# Altium project IEA_uRobots_v2.PrjPcb (part 2 of 2)
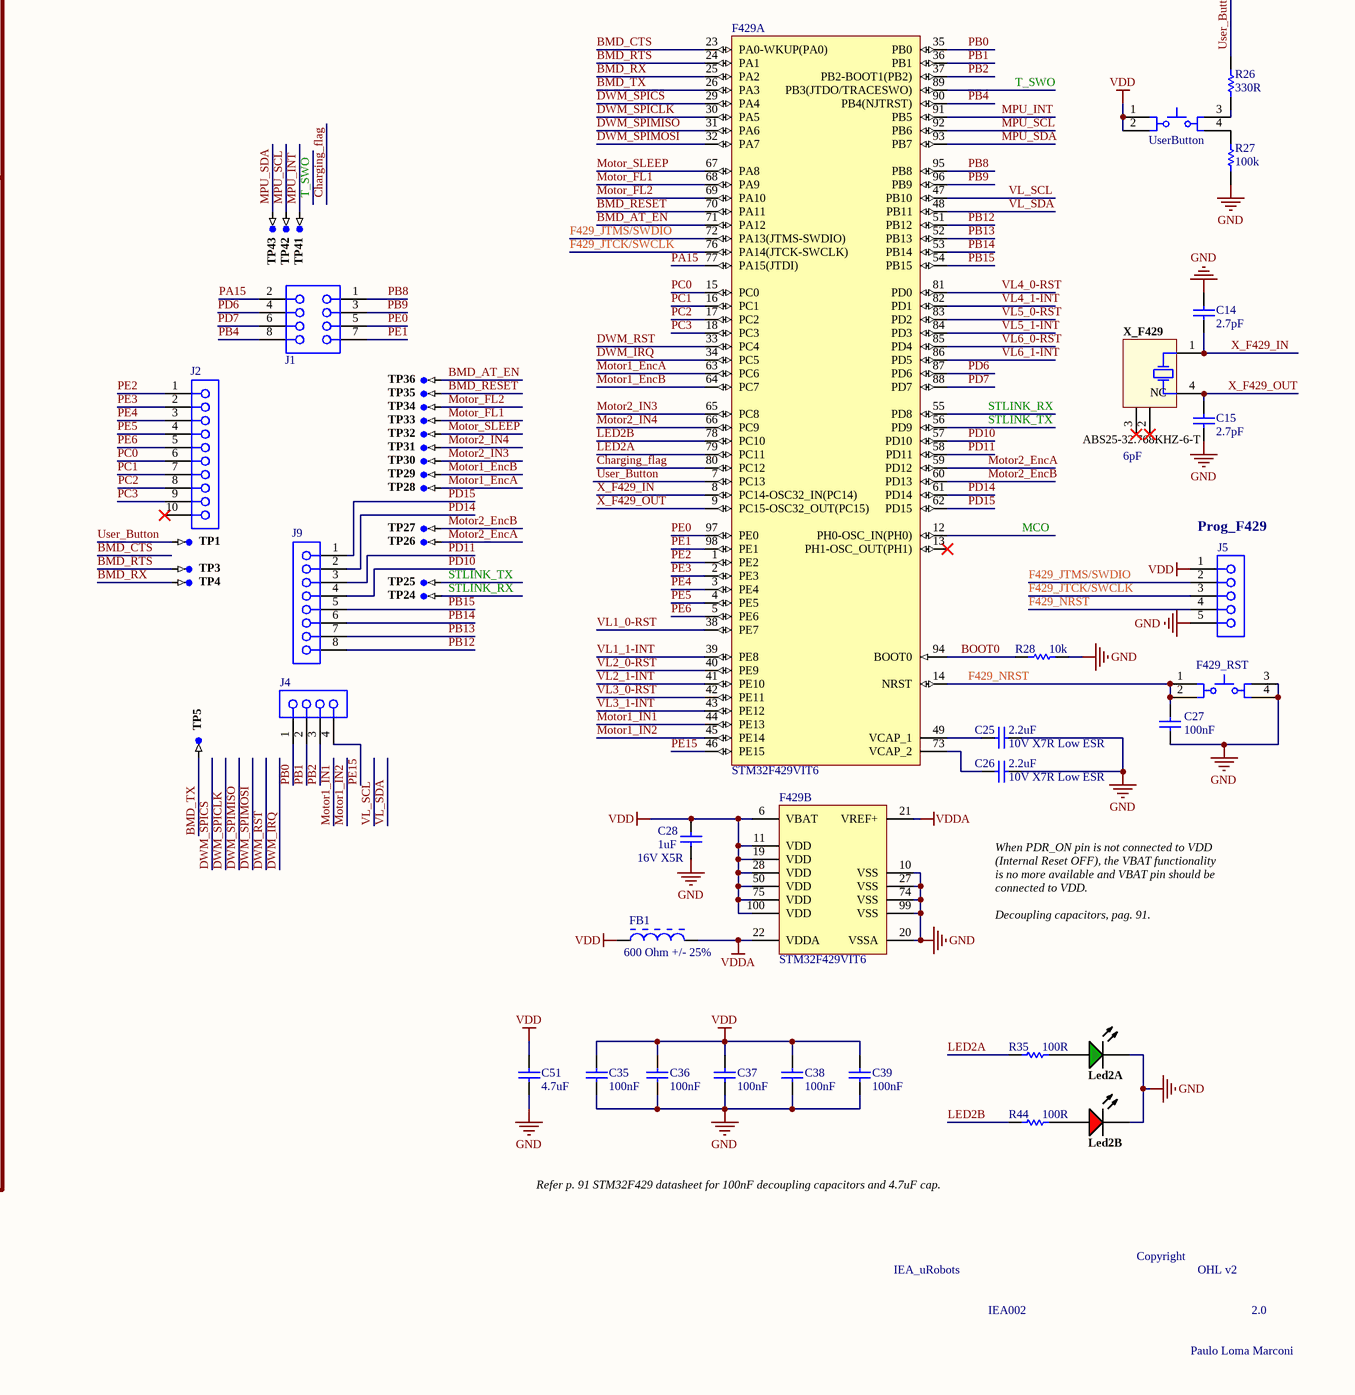
[diagram p4: IEA_uRobots_v2.SchDoc, bottom right]

## Sheet IEA_uRobots_v2.SchDoc: IEA_uRobot v2 (continued)

### Library data of the parts
3V3toVDD = CMP-1712-00002-3: Male Header, Pitch 2.54 mm, 1 x 2 Position, Height 8.54 mm, Tail Length 3 mm, -40 to 105 degC, RoHS, Bulk; PartNumber: 613 002 111 21; Mounting Technology: Through Hole; Packaging: Bulk; Pins: 2; REACH SVHC: No SVHC; PackageDescription: Male Header, Pitch 2.54 mm, 1 x 2 Position, Height 8.54 mm, Tail Length 3 mm; ComponentLink1Description: Manufacturer URL; Max Operating Temperature: 125 degC; ComponentLink1URL: https://www.we-online.com/; ComponentLink2Description: Datasheet; Mount: Through Hole; DatasheetVersion: Rev. J; Min Operating Temperature: -40 degC; ComponentLink2URL: http://katalog.we-online.de/em/datasheet/6130xx11121.pdf; RoHSCompliant: True
BAT VIN = CMP-2000-05417-1: Male Header, Pitch 2.54 mm, 1 x 2 Position, Height 10.49 mm, Tail Length 3.556 mm, -55 to 105 degC, RoHS, Bulk; Manufacturer: TE Connectivity; Standards: RoHSCompliant,ELVCompliant,UL94V-0; Material, Housing: Polyester; Agency Approvals: CSA,UL; Brand/Series: MTA-100Series; Contact Centerline Spacing: 0.100 / in.; Material, Contact: CopperAlloy; Current, Rating: 5 / A; Color, Housing: White; Contact Termination Area Plating: Tin; Special Features: Pinstrip; Number of Positions: 2; Temperature, Operating: -55to+105 / degC; Angle: Straight; Mount Angle: Vertical; Connector Type: MTA-100; Primary Type: InterconnectSystem; Voltage, Rating: 250 / V; Number of Rows: 1; Termination: Solder; Length, Terminal Post: 0.14 / in.; Manufacturer URL: http://www.te.com/; Color: White; Size, Post: 0.025 / in.; Contact Shape: Square; Mounting Type: PCMount; Datasheet URL: https://datasheet.ciiva.com/11746/0900766b80eb7fdd-11746365.pdf; Type: PCBPlug; Datasheet Version: Rev. W, 06/2004; Number of Contacts: 2; Flammability Rating: UL94V-0; Contact Plating: Tin; Contact Mating Area Plating: Tin
BMD = BMD-300-A: Bluetooth 4.2 LE Module, nRF52832, 512kB Flash, 64kB RAM; Manufacturer: Rigado; Internal Antenna: Yes; Protocol: BLE 4.2; RF Freq: 2.4GHz; Added By: Cam N; Part Number: BMD-300-A; Size: 14mm x 9.8mm; Height: 1.9mm; Added Date: 10/14/2015
BMD_AT_EN BMD_RST UserButton = CMP-2000-07594-1: Tact Switch, SPST-NO, 50 mA, -20 to 60 degC, 4-Pin SMD, RoHS, Tape and Reel; Manufacturer: C&K Components; Actuator Length: 0.85mm; Voltage Rating (DC): 12V; Mechanical Life: 100000Cycles; Illumination Type: Illuminated; Throw Configuration: SPST; Switch Function: Off-Mom; Actuator Material: Polyamide; Contact Resistance: 100mOhm; Max Current Rating: 50mA; Operating Force: 160gf; Case\/Package: SMD/SMT; Orientation: Straight; RoHSCompliant: True; Manufacturer URL: http://www.ckswitches.com/; Package Quantity: 1000; Datasheet URL: http://www.ckswitches.com/media/1471/pts645.pdf; Colour: Black; Min Operating Temperature: -20degC; Length: 6mm; Mount: SurfaceMount; Depth: 9mm; Max Voltage Rating (DC): 12V; Package Reference: PTS645S; REACH SVHC: NoSVHC; Contact Material: Silver; Packaging: TapeandReel; Package Description: 4-Pin Surface Mount Device, Body 6 x 6 mm, Pitch 4.5 mm; Max Operating Temperature: 60degC; Lead Free: LeadFree; Termination: GullWing; Current Rating: 50mA; Datasheet Version: 04/2016; Mounting Technology: SurfaceMount; Contact Plating: Silver
C1 C2 C14 C15 = CMP-1034-00206-1: CAP 2.7pF 16V ±0.25pF 0402 (1005 Metric) Thickness 0.6mm SMD; Case-Metric: 1005; Case-EIA: 0402; Tolerance: Â±0.25pF; Technology: SMT; Max Thickness: 0.6 mm; Rated Voltage: 16 V
C3 C8 = CMP-1036-00837-1: CAP 10pF 16V ±10% 0805 (2012 Metric) Thickness 1mm SMD; Tolerance: Â±10%; Case-EIA: 0805; Case-Metric: 2012; Rated Voltage: 16 V; Max Thickness: 1 mm; Technology: SMT
C4 C16 C17 C19 C21 C24 C27 C30 C32 C35-C40 C43 C52-C59 = CMP-1036-04420-1: CAP 100nF 50V ±10% 0805 (2012 Metric) Thickness 1mm SMD; Case-EIA: 0805; Tolerance: Â±10%; Case-Metric: 2012; Rated Voltage: 50 V; Max Thickness: 1 mm; Technology: SMT
C5 C51 = CMP-2007-03546-1: Manufacturer: Murata; Part Number: GRM21BR61E475MA12L
C6 C7 = CMP-1036-02452-1: CAP 300pF 50V ±1% 0805 (2012 Metric) Thickness 1mm SMD; Case-Metric: 2012; Case-EIA: 0805; Tolerance: Â±1%; Rated Voltage: 50 V; Max Thickness: 1 mm; Technology: SMT
C9 C11 = CMP-1033-00657-1: CAP 100nF 4V ±10% 0201 (0603 Metric) Thickness 0.33mm SMD; Case-EIA: 0201; Tolerance: Â±10%; Case-Metric: 0603; Technology: SMT; Max Thickness: 0.33 mm; Rated Voltage: 4 V
C10 C23 = CMP-1033-00635-1: CAP 10nF 6.3V ±10% 0201 (0603 Metric) Thickness 0.33mm SMD; Case-Metric: 0603; Tolerance: Â±10%; Case-EIA: 0201; Rated Voltage: 6.3 V; Max Thickness: 0.33 mm; Technology: SMT
C12 C13 = CMP-2000-06039-1: Chip Capacitor, 4.7 uF, +/- 10%, 25 V, -55 to 125 degC, 0805 (2012 Metric), RoHS, Tape and Reel; Manufacturer: TDK; PCN Part Number: MLCCPartNumberChange30/Nov/2012; Other Names: 445-5972-2C2012X7R1E475KC2012X7R1E475KT000N; Temperature Coefficient: X7R; Voltage - Rated: 25V; Product Training Modules: CSeriesGeneralApplicationsSEAT,CCV,andTVCLDesignToolsGuidetoReplacinganElectrolyticCapacitorwithanMLCC; Catalog Drawings: CSERIES_2012-0805_1.45; Online Catalog: CSeries,GeneralPurpose; Package Description: 2-Pin Surface Mount Device, Body 2 x 1.25 mm; Manufacturer URL: http://www.tdk.com/; Features: -; Family: CeramicCapacitors; Applications: GeneralPurpose; Standard Package: 2,000; RoHS Information: RoHSCertificate-MLCC; Operating Temperature: -55°C~125°C; Lead Spacing: -; Lead Style: -; Datasheet Version: 01/2016; Datasheet URL: https://product.tdk.com/info/en/documents/chara_sheet/C2012X7R1E475K125AB.pdf; Series: C; Package Reference: 0805; Category: Capacitors; Ratings: -; Packaging: Tape&Reel(TR); Tolerance: ±10%; Height - Seated (Max): -; Package / Case: 0805(2012Metric); Mounting Technology: SurfaceMount; Mounting Type: SurfaceMount,MLCC
C18 = CMP-2000-07390-1: Chip Capacitor, 10 uF, +/- 10%, 10 V, -55 to 85 degC, 0805 (2012 Metric), RoHS, Tape and Reel; Manufacturer: Vishay; Unit Weight: 0.000194oz; Voltage Rating DC: 10VDC; Brand: Vishay/Vitramon; Dielectric: X5R; Series: VJW1BC; Mounting Technology: SurfaceMount; Case Code - in: 0805; Package Description: 2-Pin Surface Mount Device, Body 2.00 x 1.25 mm; Case Code - mm: 2012; Length: 2mm; Datasheet Version: 07/2016; Manufacturer URL: http://www.vishay.com/; Product Category: MultilayerCeramicCapacitorsMLCC-SMD/SMT; Maximum Operating Temperature: +85C; Datasheet URL: http://www.vishay.com/docs/28548/vjw1bcbascomseries.pdf; Factory Pack Quantity: 3000; Termination Style: SMD/SMT; Package / Case: 0805(2012metric); Minimum Operating Temperature: -55C; Package Reference: 0805; RoHS: True; Width: 1.25mm; Height: 1.25mm; Tolerance: 10%; Packaging: Reel
C20 C22 C28 C29 C31 C41 C42 = CMP-1036-04747-1: CAP 1uF 16V ±10% 0805 (2012 Metric) Thickness 1mm SMD; Tolerance: Â±10%; Case-Metric: 2012; Case-EIA: 0805; Technology: SMT; Rated Voltage: 16 V; Max Thickness: 1 mm
C25 C26 = CMP-1036-04824-1: CAP 2.2uF 10V ±10% 0805 (2012 Metric) Thickness 1.45mm SMD; Case-Metric: 2012; Tolerance: Â±10%; Case-EIA: 0805; Max Thickness: 1.45 mm; Technology: SMT; Rated Voltage: 10 V
C33 C34 = CMP-2000-07390-1: Chip Capacitor, 10 uF, +/- 10%, 10 V, -55 to 85 degC, 0805 (2012 Metric), RoHS, Tape and Reel; Manufacturer: Vishay; Unit Weight: 0.000194oz; Voltage Rating DC: 10VDC; Brand: Vishay/Vitramon; Series: VJW1BC; Mounting Technology: SurfaceMount; Case Code - in: 0805; Capacitance: 10uF; Package Description: 2-Pin Surface Mount Device, Body 2.00 x 1.25 mm; Case Code - mm: 2012; Length: 2mm; Datasheet Version: 07/2016; Manufacturer URL: http://www.vishay.com/; Product Category: MultilayerCeramicCapacitorsMLCC-SMD/SMT; Maximum Operating Temperature: +85C; Datasheet URL: http://www.vishay.com/docs/28548/vjw1bcbascomseries.pdf; Factory Pack Quantity: 3000; Dielectric: X5R; Termination Style: SMD/SMT; Package / Case: 0805(2012metric); Minimum Operating Temperature: -55C; Package Reference: 0805; RoHS: True; Width: 1.25mm; Height: 1.25mm; Tolerance: 10%; Packaging: Reel
CN1 CN3 CN4 = CMP-1024-00081-1: PartNumber: MTLW-106-05-F-S-210; Manufacturer: Samtec; Pitch: 2.54 mm; Orientation: Vertical; ComponentLink1URL: http://www.samtec.com; ComponentLink3URL: http://www.samtec.com/documents/webfiles/cpdf/MTLW-1XX-XX-XX-X-XXX-XX-XX-MKT1.pdf; PackageReference: MTLW-106-05-X-S-210; DatasheetVersion: F-214; ComponentLink2URL: http://www.samtec.com/documents/webfiles/pdf/MTLW_TH.PDF; PackageVersion: T, 6/1991; RoHS: True; ComponentLink1Description: Manufacturer URL; ComponentLink3Description: Package Specification; ComponentLink2Description: Datasheet; PackageDescription: Low Profile Terminal Assembly; Temperature Range: -55 to 125 degC; Mounting Technology: Through-hole
CN2 = CMP-1024-00379-1: Manufacturer: Samtec; PartNumber: TSW-106-07-G-D; Pitch: 2.54 mm; ComponentLink1URL: http://www.samtec.com; DatasheetVersion: F-214; ComponentLink3URL: http://www.samtec.com/documents/webfiles/cpdf/TSW-XXX-XX-XXX-X-XX-XXX-MKT.pdf; PackageVersion: DM, 8/1988; Mounting Technology: Through-hole; ComponentLink1Description: Manufacturer URL; Orientation: Vertical; PackageDescription: .025[0.64] SQ. Post Terminal Strip Assembly; ComponentLink2URL: http://www.samtec.com/documents/webfiles/pdf/TSW_TH.PDF; RoHS: True; ComponentLink3Description: Package Specification; ComponentLink2Description: Datasheet; PackageReference: TSW-106-07-X-D; Temperature Range: -55 to 125 degC
D2-D4 = CMP-2000-05927-1: Small Signal Schottky Diode, 40 V, 300 mA, -40 to 150 degC, 2-Pin SOD-323, RoHS, Tape and Reel; Manufacturer: STMicroelectronics; Current - Reverse Leakage @ Vr: 1µA@30V; Capacitance @ Vr, F: 10pF@1V,1MHz; Other Related Documents: BAT54ViewAllSpecifications; Voltage - DC Reverse (Vr) (Max): 40V; Voltage - Forward (Vf) (Max) @ If: 900mV@100mA; Other Names: 497-7163-6; Reverse Recovery Time (trr): 5ns; Speed: FastRecovery=200mA(Io); Current - Average Rectified (Io): 300mA(DC); Standard Package: 1; Datasheet Version: Rev. 10, 10/2009; Package / Case: SC-76,SOD-323; Diode Type: Schottky; Package Description: 2-Pin Surface Mount Device, Body 1.66 x 1.28 mm, Height 1.17 mm; Operating Temperature - Junction: -40°C~150°C; Package Reference: SOD-323-2; Family: Diodes,Rectifiers-Single; Packaging: Digi-Reel®; Datasheet URL: http://www.stm32circle.com/resources/Datasheets/BAT60J.pdf; Supplier Device Package: SOD-323; Online Catalog: SchottkyDiode; Category: DiscreteSemiconductorProducts; Series: -; Manufacturer URL: http://www.st.com/; Mounting Technology: SurfaceMount; Mounting Type: SurfaceMount
DWM = CMP-2000-05094-1: DW M1000 IEEE 802.15.4 -2011 UWB Transceiver Module; Manufacturer: Decawave; Voltage - Supply: 2.8V~3.6V; Protocol: IR-UWB; Featured Product: ScenSorDWM1000Module; Design Resources: DevelopmentToolSelector; Frequency: 3.5GHz~6.5GHz; Antenna Type: Integrated,Chip; Other Names: 1479-1002-2RUPF-G001A; Current - Receiving: 64mA; Data Rate: 6.8Mbps; Serial Interfaces: SPI; Current - Transmitting: 31mA; Modulation: BPM,BPSK; Standard Package: 500; Series: -; RF Family/Standard: 802.15.4; Operating Temperature: -40degC~85degC; Sensitivity: -; Packaging: Tape&Reel(TR); Datasheet Version: Rev. V1.0, 12/2015; Power - Output: -; Family: RFTransceiverModules; Memory Size: -; Package / Case: Module; Mounting Type: SurfaceMount; Datasheet URL: http://www.decawave.com/sites/default/files/resources/dwm1000-datasheet-v1.3.pdf; Online Catalog: ScenSorDWM1000Module; Category: RF/IFandRFID; Manufacturer URL: http://www.decawave.com/; Supplier 1: Digi-Key; Supplier Part Number 1: 1479-1002-1-ND
ESD = CMP-2000-05378-1: Very low capacitance ESD protection, 3.5 pF, -40 to 125 degC, 6-Pin SOT23, RoHS, Tape and Reel; Manufacturer: STMicroelectronics; Polarity: Uni-Directional; Clamping Voltage: 17V; Rad Hardened: No; Product Height (mm): 1.3mm; Leakage Current (Max): 0.15uA; Product Length (mm): 3.05mm; Number of Elements: 1; Peak Pulse Current: 5A; Configuration: Dual; Reverse Breakdown Voltage: 6V; Working Voltage (Max): 5V; Capacitance Value: 3.5pF; Suppressor Type: DiodeArrays; Product Depth (mm): 1.75mm; Test Current (It): 1mA; Package / Case: SOT-23; Operating Temperature Max Deg. C: 125C; Package Description: 6-Pin Small Outline Transistor, Body 2.925 x 1.625 mm, Pitch 0.95 mm; Package Reference: SOT23-6L; Datasheet Version: Rev. 5, 10/2011; Operating Temperature Min Deg. C: -40C; Mounting Style: SurfaceMount; Direction Type: Uni-Directional; Mounting: SurfaceMount; Pin Count: 6; Leakage Current: 0.15uA; Packaging: TapeandReel; Operating Temperature Classification: Automotive; Clamping Voltage (Max): 17V; Manufacturer URL: http://www.st.com/; Reverse Stand-off Voltage: 5V; Datasheet URL: http://www.st.com/st-web-ui/static/active/en/resource/technical/document/datasheet/CD00050750.pdf; Working Voltage: 5V; Operating Temp Range: -40Cto125C; Supplier 1: Digi-Key; Supplier Part Number 1: 497-5235-1-ND
F103 = CMP-0237-00215-3: ARM Cortex-M3 32-bit MCU, 64 KB Flash, 20 KB Internal RAM, 37 I/Os, 48-pin LQFP, -40 to 85 degC, Tray; Supply Voltage(Vcc) min (V): 2; Internal RAM Size (kB): 20; FLASH Size (Prog) (kB): 64; A/D Converter: 2x12-bit (10 Channel); I/Os (High Current): 37; Operating Frequency(F) (Processor speed) (MHz): 72; Core: ARM Cortex-M3; ComponentLink3Description: Package Specification; Mounting Technology: Surface Mount; PartNumber: STM32F103C8T6; PackageReference: LQFP48; Packing: Tray; ComponentLink3URL: http://www.st.com/st-web-ui/static/active/en/resource/technical/document/datasheet/DM00058181.pdf; DatasheetVersion: Rev. 16; ComponentLink1URL: http://www.st.com/web/en/home.html; PackageVersion: Rev. 6, 06/2013; ComponentLink2URL: http://www.st.com/st-web-ui/static/active/en/resource/technical/document/datasheet/CD00161566.pdf; ComponentLink1Description: Manufacturer URL; ComponentLink2Description: Datasheet; PackageDescription: 48-Pin Low Profile Quad Flat Package, 7 x 7 mm Body, 0.5 mm Pitch; PartId: 1
F429 = CMP-0243-00030-2: ARM Cortex-M4 32-bit MCU+FPU, 225 DMIPS, 2048 kB Flash, 256 kB Internal RAM, 82 I/Os, 100-pin LQFP, -40 to 85 degC, Tray; Manufacturer: STMicroelectronics; FLASH Size (Prog) (kB): 2048; Supply Voltage(Vcc) min (V): 1.8; Operating Frequency(F) (Processor speed) (MHz): 180; Supply Voltage(Vcc) max (V): 3.6; D/A Converter: 2x12-bit; Internal RAM Size (kB): 256; I/Os (High Current): 82; Mounting Technology: Surface Mount; ComponentLink3URL: http://www.st.com/st-web-ui/static/active/en/resource/technical/document/data_brief/DM00071938.pdf; ComponentLink2URL: http://www.st.com/st-web-ui/static/active/en/resource/technical/document/data_brief/DM00053488.pdf; ComponentLink3Description: Package Specification; Packing: Tray; PackageDescription: 100-Pin Low Profile Quad Flat Package, 14 x 14 mm Body, 0.5 mm Pitch; PartNumber: STM32F429VIT6; ComponentLink2Description: Datasheet; ComponentLink1Description: Manufacturer URL; ComponentLink1URL: http://www.st.com/web/en/home.html; DatasheetVersion: Rev. 2; Core: ARM Cortex-M4; PackageReference: LQFP100; PackageVersion: Rev. 1, 06/2013; PartId: 1
F429_RST = CMP-2000-07594-1: Tact Switch, SPST-NO, 50 mA, -20 to 60 degC, 4-Pin SMD, RoHS, Tape and Reel; Manufacturer: C&K Components; Actuator Length: 0.85mm; Voltage Rating (DC): 12V; Mechanical Life: 100000Cycles; Illumination Type: Illuminated; Colour: Black; Throw Configuration: SPST; Switch Function: Off-Mom; Actuator Material: Polyamide; Contact Resistance: 100mOhm; Max Current Rating: 50mA; Operating Force: 160gf; Case\/Package: SMD/SMT; Orientation: Straight; RoHSCompliant: True; Manufacturer URL: http://www.ckswitches.com/; Package Quantity: 1000; Datasheet URL: http://www.ckswitches.com/media/1471/pts645.pdf; Min Operating Temperature: -20degC; Length: 6mm; Mount: SurfaceMount; Depth: 9mm; Max Voltage Rating (DC): 12V; Package Reference: PTS645S; REACH SVHC: NoSVHC; Contact Material: Silver; Packaging: TapeandReel; Package Description: 4-Pin Surface Mount Device, Body 6 x 6 mm, Pitch 4.5 mm; Max Operating Temperature: 60degC; Lead Free: LeadFree; Termination: GullWing; Current Rating: 50mA; Datasheet Version: 04/2016; Mounting Technology: SurfaceMount; Contact Plating: Silver
FB1 = CMP-0686-00639-2: Chip Ferrite Bead for General Signal lines, 600 Ohm, 600 mA, -55 to 125 degC, 2 x 1.25 x 1.05 mm SMD, Tape and Reel; Manufacturer: Murata; Rated Current: 600 mA; DC Resistance: 0.21 Ohm Max.; PackageReference: BLM21_H1050-2; ComponentLink2Description: Datasheet; PartNumber: BLM21AG601SN1D; PackageDescription: 2-Pin Chip, Body 2 x 1.25 mm; ComponentLink3Description: Package Specification; ComponentLink2URL: http://www.murata.com/products/catalog/pdf/c31e.pdf; ComponentLink3URL: http://www.murata.com/products/catalog/pdf/c31e.pdf; ComponentLink1Description: Manufacturer URL; Mounting Technology: Surface Mount; Packing: Tape and Reel; Operating Temperature Range: -55 to 125 degC; ComponentLink1URL: http://www.murata.com/; DatasheetVersion: 08/2013
IMU#1 IMU#2 = CMP-2100-03657-1: 9-axis MotionTracking device, 2.4 to 3,6 V, -40 to 85 degC, 24-Pin QFN, RoHS, Tape and Reel; Manufacturer: InvenSense; Max Supply Voltage: 3.6V; Min Supply Voltage: 2.4V; Package Reference: QFN-24; Package Quantity: 1; Datasheet Version: Rev. 1.0, 01/2014; Case/Package: QFN; Package Description: 24-Pin Quad Flat No-lead Package, Body 3 x 3 mm, Pitch 0.4 mm; RoHSCompliant: true; Max Operating Temperature: 85degC; Height: 1mm; Mount: SurfaceMount; Manufacturer URL: http://www.invensense.com/; Width: 3.1mm; Min Operating Temperature: -40degC; Length: 3.1mm; PartId: 1
  IMU#1: Datasheet URL: https://www.invensense.com/wp-content/uploads/2015/02/PS-MPU-9250A-01-v1.1.pdf
  IMU#2: Datasheet URL: http://datasheet.octopart.com/MPU-9250-InvenSense-datasheet-21859386.pdf
J1 = CMP-1023-00342-1: SQ Post Socket, Through-hole, Vertical, -55 to 105 degC, 2.54mm Pitch, 8-Pin, Female, RoHS; Manufacturer: Samtec; Mounting Technology: Through-hole; ComponentLink3Description: Package Specification; ComponentLink3URL: http://www.samtec.com/documents/webfiles/cpdf/SSW-1XX-XX-XXX-X-XX-XXX-XX-MKT.pdf; Temperature Range: -55 to 105 degC; DatasheetVersion: F-214; PackageVersion: CA, 6/1987; ComponentLink1URL: http://www.samtec.com; RoHS: True; Pitch: 2.54 mm; ComponentLink2Description: Datasheet; ComponentLink2URL: http://www.samtec.com/documents/webfiles/pdf/SSW_TH.PDF; PackageDescription: Assembly, Socket Strip .016 X .031 Tail; PackageReference: SSW-104-02-X-D; ComponentLink1Description: Manufacturer URL; PartNumber: SSW-104-02-T-D; Orientation: Vertical
J2 = CMP-1272-00002-1: SOCKET, Through-hole, Vertical, -55 to 125 degC, 2.54 mm Pitch, 10-Pin Female, RoHS; Manufacturer: Samtec; Packing: Bulk; Number of Positions: 10; Pitch: 2.54 mm; PackageVersion: Rev. A; ComponentLink1Description: Manufacturer URL; Contact Type: Female Socket; ComponentLink2URL: http://www.samtec.com/documents/webfiles/cpdf/SSW-1XX-XX-XXX-X-XX-XXX-XX-MKT.pdf; DatasheetVersion: Rev. CA; ComponentLink1URL: http://www.samtec.com/; Orientation: Vertical; PackageDescription: 1x10 Pins SQ Post Socket, Vertical, Body 25.5 x 2.41 mm, Pitch 2.54 mm, Female; Operating Temperature Range: -55 to 125 degC; PartNumber: SSW-110-01-G-S; ComponentLink3URL: http://www.samtec.com/documents/webfiles/cpdf/SSW-S.PDF; Contact Finish: Gold; Mounting Technology: Through Hole; ComponentLink3Description: Package Specification; Number of Rows: 1; RoHS: TRUE; Termination: Through-hole; ComponentLink2Description: Datasheet
J3 J4 = CMP-1023-00130-1: Low Profile Socket Strips, Through-hole, Vertical, -55 to 125 degC, 2.54 mm Pitch, 4-Pin, Female, RoHS; Manufacturer: Samtec; Pitch: 2.54 mm; PackageReference: SLW-104-01-X-S; PartNumber: SLW-104-01-G-S; Orientation: Vertical; ComponentLink1Description: Manufacturer URL; PackageVersion: X, 9/1987; RoHS: True; Temperature Range: -55 to 125 degC; DatasheetVersion: F-214; ComponentLink3URL: http://www.samtec.com/documents/webfiles/cpdf/SLW-1XX-01-X-X-MKT.pdf; Mounting Technology: Through-hole; PackageDescription: Low Profile Socket Strip; ComponentLink2Description: Datasheet; ComponentLink3Description: Package Specification; ComponentLink2URL: http://www.samtec.com/documents/webfiles/pdf/SLW.PDF; ComponentLink1URL: http://www.samtec.com
J5 J8 = CMP-1023-00344-1: SQ Post Socket, Through-hole, Vertical, -55 to 125 degC, 2.54mm Pitch, 5-Pin, Female, RoHS; Manufacturer: Samtec; RoHS: True; Pitch: 2.54 mm; DatasheetVersion: F-214; ComponentLink3Description: Package Specification; ComponentLink2Description: Datasheet; ComponentLink3URL: http://www.samtec.com/documents/webfiles/cpdf/SSW-1XX-XX-XXX-X-XX-XXX-XX-MKT.pdf; Temperature Range: -55 to 125 degC; PackageDescription: Assembly, Socket Strip .016 X .031 Tail; ComponentLink1URL: http://www.samtec.com; PackageVersion: CA, 6/1987; ComponentLink1Description: Manufacturer URL; PartNumber: SSW-105-01-G-S; Orientation: Vertical; ComponentLink2URL: http://www.samtec.com/documents/webfiles/pdf/SSW_TH.PDF; Mounting Technology: Through-hole; PackageReference: SSW-105-01-X-S
J6 = CMP-1023-00013-1: Tiger Claw(TM) Pass-Through Socket, Vertical, -55 to 125 degC, 2.54 mm Pitch, 10-Pin, Female, RoHS; Manufacturer: Samtec; Pitch: 2.54 mm; Orientation: Vertical; ComponentLink1Description: Manufacturer URL; PackageReference: BCS-105-X-D-TE; ComponentLink2URL: http://www.samtec.com/documents/webfiles/pdf/BCS.PDF; ComponentLink2Description: Datasheet; Temperature Range: -55 to 125 degC; PackageDescription: Box Connector Socket Strip; PartNumber: BCS-105-F-D-TE; Mounting Technology: Through-hole; PackageVersion: BV, 9/1991; DatasheetVersion: F-214; ComponentLink3Description: Package Specification; RoHS: True; ComponentLink1URL: http://www.samtec.com; ComponentLink3URL: http://www.samtec.com/documents/webfiles/cpdf/BCS-1XX-XXX-X-XX-XXX-MKT.pdf
J7 = CMP-1272-00001-1: SOCKET, Through-hole, Vertical, -55 to 125 degC, 2.54 mm Pitch, 8-Pin Female, RoHS; Manufacturer: Samtec; Number of Positions: 8; Packing: Bulk; Pitch: 2.54 mm; PartNumber: SSW-108-01-G-S; PackageDescription: 1x8 Pins SQ Post Socket, Vertical, Body 20.5 x 2.41 mm, Pitch 2.54 mm, Female; Termination: Through-hole; ComponentLink2URL: http://www.samtec.com/documents/webfiles/cpdf/SSW-1XX-XX-XXX-X-XX-XXX-XX-MKT.pdf; PackageVersion: Rev. A; ComponentLink3URL: http://www.samtec.com/documents/webfiles/cpdf/SSW-S.PDF; ComponentLink2Description: Datasheet; Mounting Technology: Through Hole; Orientation: Vertical; DatasheetVersion: Rev. CA; ComponentLink1Description: Manufacturer URL; Operating Temperature Range: -55 to 125 degC; RoHS: TRUE; Contact Finish: Gold; Contact Type: Female Socket; Number of Rows: 1; ComponentLink1URL: http://www.samtec.com/; ComponentLink3Description: Package Specification
J9 = CMP-1023-00295-1: SQ Post Socket, Through-hole, Vertical, -55 to 125 degC, 2.54 mm Pitch, 8-Pin, Female, RoHS; Manufacturer: Samtec; Pitch: 2.54 mm; ComponentLink1Description: Manufacturer URL; ComponentLink3Description: Package Specification; Mounting Technology: Through-hole; Temperature Range: -55 to 125 degC; PackageVersion: BD, 6/1987; Orientation: Vertical; PackageReference: SSQ-108-01-X-S; PartNumber: SSQ-108-01-L-S; ComponentLink2URL: http://www.samtec.com/documents/webfiles/pdf/SSQ_TH.PDF; RoHS: True; PackageDescription: Assembly, Socket Strip .025[0.64] SQ Tail; DatasheetVersion: F-214; ComponentLink3URL: http://www.samtec.com/documents/webfiles/cpdf/SSQ-1XX-XX-XXX-X-XX-XXX-XX-X-MKT.pdf; ComponentLink2Description: Datasheet; ComponentLink1URL: http://www.samtec.com
J10 M1 M2 VL1-VL6 = CMP-1023-00359-1: SQ Post Socket, Through-hole, Vertical, -55 to 125 degC, 2.54mm Pitch, 6-Pin, Female, RoHS; Manufacturer: Samtec; ComponentLink1Description: Manufacturer URL; Pitch: 2.54 mm; ComponentLink1URL: http://www.samtec.com; ComponentLink2Description: Datasheet; PackageVersion: CA, 6/1987; Orientation: Vertical; RoHS: True; PackageReference: SSW-106-02-X-S; ComponentLink2URL: http://www.samtec.com/documents/webfiles/pdf/SSW_TH.PDF; Mounting Technology: Through-hole; Temperature Range: -55 to 125 degC; PackageDescription: Assembly, Socket Strip .016 X .031 Tail; DatasheetVersion: F-214; ComponentLink3Description: Package Specification; PartNumber: SSW-106-02-G-S; ComponentLink3URL: http://www.samtec.com/documents/webfiles/cpdf/SSW-1XX-XX-XXX-X-XX-XXX-XX-MKT.pdf
Led = CMP-2000-06423-1: Bi-Colour Green Red LED, 2.2 V Green, 2.1 V Red, -40 to 85 degC, 4-Pin SMD, RoHS, Tape and Reel; Manufacturer: Avago; Product Depth (mm): 3.2mm; Rad Hardened: No; Product Height (mm): 1.1mm; Viewing Angle: 170deg; Test Current (It): 20mA; Main Category: ChipLED; Peak Wavelength: 570/630nm; Luminous Intensity: 15/10mcd; DELETED: Compliant; Lens Type: ColorlessDiffused; Number of  Elements: 2; Shape Type: Rectangular; Dominant Wave Length: 572/626nm; Power Dissipation: 65W; Product Length (mm): 2.7mm; Emitting Color: YellowGreen/Red; Chip Material: GaP; Forward Voltage: 2.6V; Reverse Voltage: 5V; Operating Temperature Classification: Industrial; Lens Dimensions: 2x2.7x0.6mm; Operating Temp Range: -40Cto85C; Packaging: TapeandReel; Mounting: SurfaceMount; Package Type: ChipLed; Mounting Technology: SurfaceMount; Package Description: 4-Pin Surface Mount Device, Body 2.7 x 3.2 mm, Pitch 1.4 mm; Forward Current: 20mA; High Brightness: No; Package Reference: HSMF-C15X; Datasheet Version: 05/2010; Datasheet URL: http://www.avagotech.com/docs/AV02-0427EN; Lum Intensity: 15/10mcd; Type: Bi-Color; Pin Count: 4; Manufacturer URL: http://www.avagotech.com/; PartId: 1
Led2 = CMP-2000-06423-1: Bi-Colour Green Red LED, 2.2 V Green, 2.1 V Red, -40 to 85 degC, 4-Pin SMD, RoHS, Tape and Reel; Manufacturer: Avago; Product Depth (mm): 3.2mm; Rad Hardened: No; Product Height (mm): 1.1mm; Viewing Angle: 170deg; Test Current (It): 20mA; Main Category: ChipLED; Peak Wavelength: 570/630nm; Luminous Intensity: 15/10mcd; DELETED: Compliant; Lens Type: ColorlessDiffused; Number of  Elements: 2; Shape Type: Rectangular; Dominant Wave Length: 572/626nm; Power Dissipation: 65W; Product Length (mm): 2.7mm; Emitting Color: YellowGreen/Red; Chip Material: GaP; Forward Voltage: 2.6V; Type: Bi-Color; Reverse Voltage: 5V; Operating Temperature Classification: Industrial; Lens Dimensions: 2x2.7x0.6mm; Operating Temp Range: -40Cto85C; Packaging: TapeandReel; Mounting: SurfaceMount; Package Type: ChipLed; Mounting Technology: SurfaceMount; Package Description: 4-Pin Surface Mount Device, Body 2.7 x 3.2 mm, Pitch 1.4 mm; Forward Current: 20mA; High Brightness: No; Package Reference: HSMF-C15X; Datasheet Version: 05/2010; Datasheet URL: http://www.avagotech.com/docs/AV02-0427EN; Lum Intensity: 15/10mcd; Pin Count: 4; Manufacturer URL: http://www.avagotech.com/; PartId: 1
LiIon = CMP-0133-00144-1: Miniature Single-Cell, Fully Integrated Li-Ion, Li-Polymer Charge Management Controller, 4.2V, 5-Pin SOT-23, Industrial Temperature, Tape and Reel; DatasheetVersion: revE, Sep-2008; PackageVersion: revBB, Aug-2009; PackageReference: SOT-23-OT5; PackageDescription: 5-Lead Plastic Small Outline Transistor (OT) [SOT-23]; Code_IPC: SOT23-5; Supplier 1: Digi-Key; Supplier Part Number 1: MCP73831T-2ATI/OTCT-ND
R1-R4 R15 R19 = CMP-1013-00320-1: 22R 0.125W 1% 0805 (2012 Metric)  SMD; Case-EIA: 0805; Case-Metric: 2012; Technology: SMT; Power: 0.125 W; Tolerance: 1 %
R5-R7 R9 R18 R35 R44 = CMP-1013-00397-1: 100R 0.125W 1% 0805 (2012 Metric)  SMD; Case-Metric: 2012; Case-EIA: 0805; Technology: SMT; Power: 0.125 W; Tolerance: 1 %
R8 R10 R14 R16 R17 R28 = CMP-1013-00623-1: 10K 0.125W 1% 0805 (2012 Metric)  SMD; Case-Metric: 2012; Case-EIA: 0805; Tolerance: 1 %; Power: 0.125 W; Technology: SMT
R11 R20 R24 R25 R27 = CMP-1013-00736-1: 100K 0.125W 1% 0805 (2012 Metric)  SMD; Case-Metric: 2012; Case-EIA: 0805; Tolerance: 1 %; Technology: SMT; Power: 0.125 W
R12 R13 = CMP-1013-00586-1: 4K7 0.125W 1% 0805 (2012 Metric)  SMD; Case-Metric: 2012; Case-EIA: 0805; Technology: SMT; Power: 0.125 W; Tolerance: 1 %
R21 = CMP-1013-00528-1: 1K5 0.125W 1% 0805 (2012 Metric)  SMD; Case-Metric: 2012; Case-EIA: 0805; Technology: SMT; Power: 0.125 W; Tolerance: 1 %
R22 R36-R43 = CMP-1013-00001-1: Jumper 0805 (2012 Metric); Case-EIA: 0805; Value: 0.00 Ohm; Tolerance: None; Case-Metric: 2012; Technology: SMT; Power: None
R23 = CMP-1013-00542-1: 2K 0.125W 1% 0805 (2012 Metric)  SMD; Case-Metric: 2012; Case-EIA: 0805; Technology: SMT; Power: 0.125 W; Tolerance: 1 %
R26 = CMP-1013-00454-1: 330R 0.125W 1% 0805 (2012 Metric)  SMD; Case-EIA: 0805; Case-Metric: 2012; Power: 0.125 W; Tolerance: 1 %; Technology: SMT
R29 R30 = CMP-1013-00171-1: 1R 0.125W 1% 0805 (2012 Metric)  SMD; Case-EIA: 0805; Case-Metric: 2012; Technology: SMT; Tolerance: 1 %; Power: 0.125 W
R31 R33 = CMP-1013-00510-1: 1K 0.125W 1% 0805 (2012 Metric)  SMD; Case-Metric: 2012; Case-EIA: 0805; Tolerance: 1 %; Power: 0.125 W; Technology: SMT
R32 R34 = CMP-1013-00546-1: 2K2 0.125W 1% 0805 (2012 Metric)  SMD; Case-Metric: 2012; Case-EIA: 0805; Power: 0.125 W; Tolerance: 1 %; Technology: SMT
TP1 TP3-TP5 TP24-TP36 TP41-TP43 = CMP-0484-00002-2: Test Point, Surface Mount, Circular, Pad Diameter 1 mm; Manufacturer: No Vendor; PartNumber: TP-SM-C-100
U1 = A3906SESTR-T: Low Voltage Stepper and Single/Dual DC Motor Driver; Datasheet: http://www.allegromicro.com/~/media/Files/Datasheets/A3906-Datasheet.ashx; Supplier 1: Digi-Key; Supplier Part Number 1: 620-1288-1-ND
U2 = CMP-0244-00328-1: 150mA, Ultra-Low Drop Low Noise BiCMOS Voltage Regulators Low ESR Capacitors Compatible, 3.3V, 5-Pin SOT23-5L; ComponentLink1Description: Manufacturer URL; ComponentLink2URL: http://www.st.com/internet/com/TECHNICAL_RESOURCES/TECHNICAL_LITERATURE/DATASHEET/CD00003395.pdf; PackageReference: SOT23-5L; ComponentLink1URL: http://www.st.com; ComponentLink2Description: Datasheet; PackageVersion: 1/01/2008; PackageDescription: 5-Pin SOT-23 Package, 2.9 x 1.6 mm Body, 0.95 mm Pitch, 2.8 mm Lead Span; DatasheetVersion: 3/01/2011
U3 = NCP186AMX330TAG: Fast Transient Response Low Voltage 1A LDO; Datasheet: http://www.onsemi.com/pub/Collateral/NCP186-D.PDF; Supplier 1: Digi-Key; Supplier Part Number 1: NCP186AMX330TAGOSCT-ND
U4 = CMP-0244-00312-1: Fixed Low Drop Positive Voltage Regulator, 5V, 4-Pin SOT-223, Tape and Reel; ComponentLink1URL: http://www.st.com; DatasheetVersion: 1/11/2011; PackageDescription: 4-Pin SOT-223 Package, 6.5 x 3.5 mm Body, 2.3 mm Pitch, 7 mm Lead Span; ComponentLink2URL: http://www.st.com/internet/com/TECHNICAL_RESOURCES/TECHNICAL_LITERATURE/DATASHEET/CD00000544.pdf; ComponentLink1Description: Manufacturer URL; PackageReference: SOT-223; PackageVersion: 2010; ComponentLink2Description: Datasheet
U5 = CMP-0244-00288-1: 500 mA Low Quiescent Current Low Noise Voltage Regulator, 3.3V, 6-Pin VDFDPN, Tape and Reel; PackageReference: DFN6D; ComponentLink1Description: Manufacturer URL; ComponentLink1URL: http://www.st.com; PackageVersion: 2008; PackageDescription: 6-Pin Plastic, Dual LLP, 3 x 3 mm Body, 0.95 mm Pitch, Exposed Pad; ComponentLink2URL: http://www.st.com/internet/com/TECHNICAL_RESOURCES/TECHNICAL_LITERATURE/DATASHEET/CD00227527.pdf; DatasheetVersion: 1/03/2009; ComponentLink2Description: Datasheet
USB = CMP-2000-05118-1: Micro USB B Type Receptacle, -55 to 85 degC, 5-Pin SMD, RoHS, Tape and Reel; Manufacturer: FCI; Current Rating: 1.8A; Number of Contacts: 5Contact; Mounting Angle: Right; Insulation Resistance: 1000MOhms; Connector Type: MicroUSBTypeBreceptacle; Gender: Female; Packaging: Reel; Termination Style: SMD/SMT; Product Category: USBConnectors; RoHS: Details; Flammability Rating: UL94V-0; Standard: USB2.0; Brand: FCI; Manufacturer URL: http://www.fci.com/; Product: MicroUSBTypeBConnectors; Operating Temperature Range: -55Cto+85C; Datasheet Version: Rev. B, 05/2015; Contact Material: CopperAlloy; Contact Plating: Gold; Datasheet URL: http://www.mouser.com/ds/2/154/10118192-793027.pdf; Color: Black; Factory Pack Quantity: 1400; Supplier 1: Digi-Key; Supplier Part Number 1: 609-4613-1-ND
X_BMD X_F429 = CMP-2000-05036-1: Low Frequency Crystal, 32.768 KHz, 6 pF, +/- 20 ppm, -40 to 85 degC, 4-Pin SMD, RoHS, Tape and Reel; Manufacturer: Abracon; Tolerance: 20PPM; ESR: 50kOhms; Case Width: 3.8mm; Case Height: 2.5mm; Case Length: 8mm; Operating Temperature Range: -40Cto+85C; Package Reference: ABS25; Factory Pack Quantity: 3000; Package Description: 4-Pin Surface Mount Device, Body 8 x 3.8 mm, Pitch 5.5 mm; Frequency: 32.768kHz; Termination Style: SMD/SMT; Manufacturer URL: http://www.abracon.com/; Type: LowFrequencyCrystal; Dimensions: 3.8mmWx8mmLx2.5mmH; Product Category: Crystals; Series: ABS25; RoHS: Details; Package / Case: 8mmx3.8mm; Datasheet Version: Jun-17; Brand: ABRACON; Datasheet URL: https://datasheet.ciiva.com/854/abs25-854528.pdf; Packaging: Reel; Mounting Style: SMD/SMT
XSTlink = CMP-2000-05730-1: Ceramic Crystal, 8 MHz, +/- 10 ppm, -10 to 60 degC, 4-Pin SMD, RoHS, Tape and Reel; Manufacturer: Abracon-LLC; ESR (Equivalent Series Resistance): 200Ohm; Frequency: 8MHz; Frequency Tolerance: ±10ppm; Operating Mode: Fundamental; Load Capacitance: 10pF; Ratings: -; Mounting Type: SurfaceMount; Type: MHzCrystal; Operating Temperature: -10°C~60°C; Package / Case: 4-SMD,NoLead(DFN,LCC); Family: Crystals; Category: CrystalsandOscillators; Frequency Stability: ±10ppm; Mounting Technology: SurfaceMount; Datasheet URL: http://www.abracon.com/Resonators/abm3b.pdf; Datasheet Version: 08/2015; Manufacturer URL: http://www.abracon.com/; Series: ABM3B; Packaging: Tape&amp;Reel(TR); Package Reference: ABM3B; Package Description: 4-Pin Surface Mount Device, Body 5 x 3.2 mm